# Altium project de10nano.PrjPcb
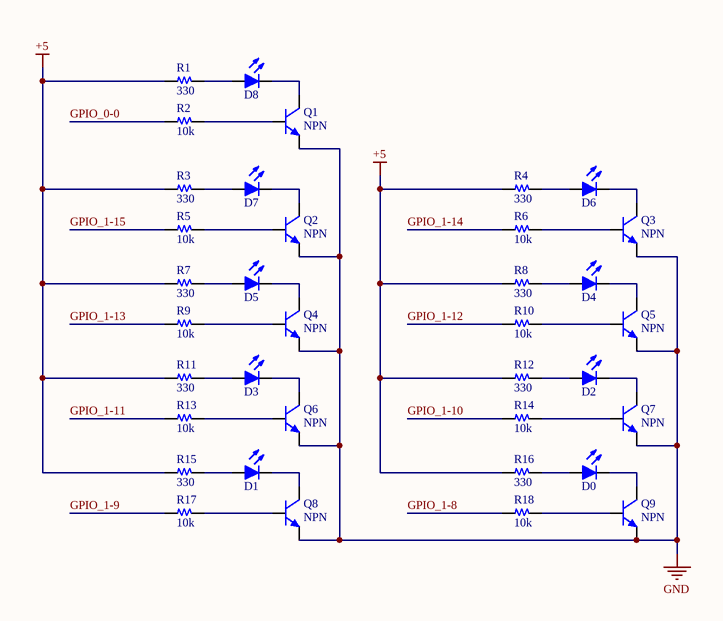
[diagram p0: led.SchDoc]
8 sheets, 203 parts. Net scope: global (net labels, ports and power ports of the same name join across sheets).
Board files: PCB1.PcbDoc, de10nano.PcbDoc, PCB2.PcbDoc
Sheets:
  led.SchDoc
  switch.SchDoc
  7seg.SchDoc
  gpio.SchDoc
  lcd.SchDoc
  buzzer.SchDoc
  button.SchDoc
  matrix.SchDoc

## Sheet led.SchDoc
size A4; SheetNumber: 1; SheetTotal: 8

### Parts
D0  Led  [Led 0805]  (value not drawn)
D1  Led  [Led 0805]  (value not drawn)
D2  Led  [Led 0805]  (value not drawn)
D3  Led  [Led 0805]  (value not drawn)
D4  Led  [Led 0805]  (value not drawn)
D5  Led  [Led 0805]  (value not drawn)
D6  Led  [Led 0805]  (value not drawn)
D7  Led  [Led 0805]  (value not drawn)
D8  Led  [Led 0805 RED]  (value not drawn)
Q1  NPN  [SOT-23]
Q2  NPN  [SOT-23]
Q3  NPN  [SOT-23]
Q4  NPN  [SOT-23]
Q5  NPN  [SOT-23]
Q6  NPN  [SOT-23]
Q7  NPN  [SOT-23]
Q8  NPN  [SOT-23]
Q9  NPN  [SOT-23]
R1  330  [R 0603]
R2  10k  [R 0603]
R3  330  [R 0603]
R4  330  [R 0603]
R5  10k  [R 0603]
R6  10k  [R 0603]
R7  330  [R 0603]
R8  330  [R 0603]
R9  10k  [R 0603]
R10  10k  [R 0603]
R11  330  [R 0603]
R12  330  [R 0603]
R13  10k  [R 0603]
R14  10k  [R 0603]
R15  330  [R 0603]
R16  330  [R 0603]
R17  10k  [R 0603]
R18  10k  [R 0603]

### Nets
+5: R1.1 R3.1 R4.1 R7.1 R8.1 R11.1 R12.1 R15.1 R16.1
GND: Q1.2(E) Q2.2(E) Q3.2(E) Q4.2(E) Q5.2(E) Q6.2(E) Q7.2(E) Q8.2(E) Q9.2(E)
GPIO_0-0: R2.1
GPIO_1-8: R18.1
GPIO_1-9: R17.1
GPIO_1-10: R14.1
GPIO_1-11: R13.1
GPIO_1-12: R10.1
GPIO_1-13: R9.1
GPIO_1-14: R6.1
GPIO_1-15: R5.1
NetD0_1: D0.1(A) R16.2
NetD0_2: D0.2(K) Q9.3(C)
NetD1_1: D1.1(A) R15.2
NetD1_2: D1.2(K) Q8.3(C)
NetD2_1: D2.1(A) R12.2
NetD2_2: D2.2(K) Q7.3(C)
NetD3_1: D3.1(A) R11.2
NetD3_2: D3.2(K) Q6.3(C)
NetD4_1: D4.1(A) R8.2
NetD4_2: D4.2(K) Q5.3(C)
NetD5_1: D5.1(A) R7.2
NetD5_2: D5.2(K) Q4.3(C)
NetD6_1: D6.1(A) R4.2
NetD6_2: D6.2(K) Q3.3(C)
NetD7_1: D7.1(A) R3.2
NetD7_2: D7.2(K) Q2.3(C)
NetD8_1: D8.1(A) R1.2
NetD8_2: D8.2(K) Q1.3(C)
NetQ1_1: Q1.1(B) R2.2
NetQ2_1: Q2.1(B) R5.2
NetQ3_1: Q3.1(B) R6.2
NetQ4_1: Q4.1(B) R9.2
NetQ5_1: Q5.1(B) R10.2
NetQ6_1: Q6.1(B) R13.2
NetQ7_1: Q7.1(B) R14.2
NetQ8_1: Q8.1(B) R17.2
NetQ9_1: Q9.1(B) R18.2

### Library data of the parts
D0-D8 = Led: Typical LED
Q1-Q9 = Transistor NPN: NPN Bipolar Transistor
R1-R18 = Resistor

## Sheet switch.SchDoc
size A4; SheetNumber: 2; SheetTotal: 8
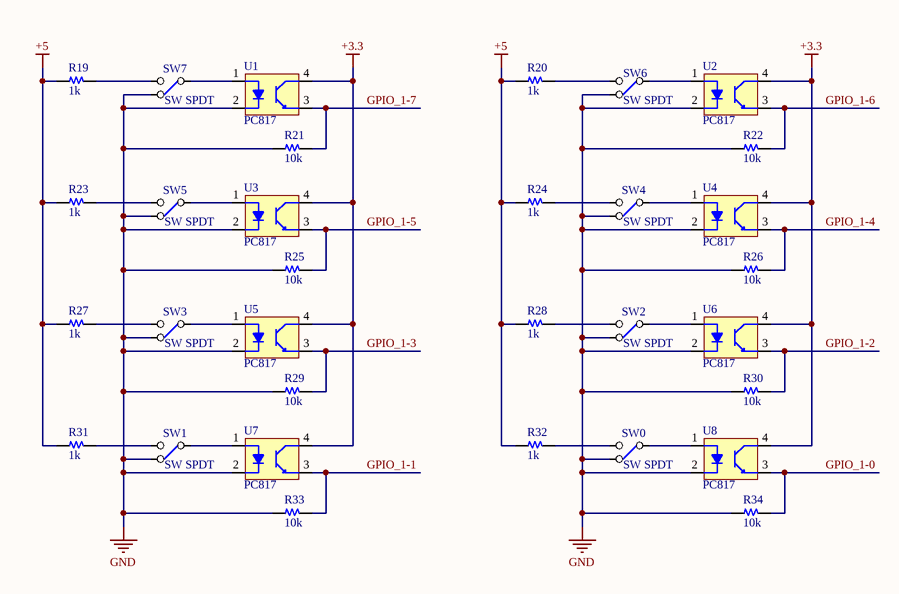
[diagram p1: switch.SchDoc]

### Parts
R19  1k  [R 0603]
R20  1k  [R 0603]
R21  10k  [R 0603]
R22  10k  [R 0603]
R23  1k  [R 0603]
R24  1k  [R 0603]
R25  10k  [R 0603]
R26  10k  [R 0603]
R27  1k  [R 0603]
R28  1k  [R 0603]
R29  10k  [R 0603]
R30  10k  [R 0603]
R31  1k  [R 0603]
R32  1k  [R 0603]
R33  10k  [R 0603]
R34  10k  [R 0603]
SW0  SW SPDT  [SW/3/SPDT/SS12D10]
SW1  SW SPDT  [SW/3/SPDT/SS12D10]
SW2  SW SPDT  [SW/3/SPDT/SS12D10]
SW3  SW SPDT  [SW/3/SPDT/SS12D10]
SW4  SW SPDT  [SW/3/SPDT/SS12D10]
SW5  SW SPDT  [SW/3/SPDT/SS12D10]
SW6  SW SPDT  [SW/3/SPDT/SS12D10]
SW7  SW SPDT  [SW/3/SPDT/SS12D10]
U1  PC817  [SOP4 - PC817]
U2  PC817  [SOP4 - PC817]
U3  PC817  [SOP4 - PC817]
U4  PC817  [SOP4 - PC817]
U5  PC817  [SOP4 - PC817]
U6  PC817  [SOP4 - PC817]
U7  PC817  [SOP4 - PC817]
U8  PC817  [SOP4 - PC817]

### Nets
+3.3: U1.4(C) U2.4(C) U3.4(C) U4.4(C) U5.4(C) U6.4(C) U7.4(C) U8.4(C)
+5: R19.1 R20.1 R23.1 R24.1 R27.1 R28.1 R31.1 R32.1
GND: R21.1 R22.1 R25.1 R26.1 R29.1 R30.1 R33.1 R34.1 SW0.1(NC1) SW1.1(NC1) SW2.1(NC1) SW3.1(NC1) SW4.1(NC1) SW5.1(NC1) SW6.1(NC1) SW7.1(NC1) U1.2(K) U2.2(K) U3.2(K) U4.2(K) U5.2(K) U6.2(K) U7.2(K) U8.2(K)
GPIO_1-0: R34.2 U8.3(E)
GPIO_1-1: R33.2 U7.3(E)
GPIO_1-2: R30.2 U6.3(E)
GPIO_1-3: R29.2 U5.3(E)
GPIO_1-4: R26.2 U4.3(E)
GPIO_1-5: R25.2 U3.3(E)
GPIO_1-6: R22.2 U2.3(E)
GPIO_1-7: R21.2 U1.3(E)
NetR19_2: R19.2 SW7.3(NO1)
NetR20_2: R20.2 SW6.3(NO1)
NetR23_2: R23.2 SW5.3(NO1)
NetR24_2: R24.2 SW4.3(NO1)
NetR27_2: R27.2 SW3.3(NO1)
NetR28_2: R28.2 SW2.3(NO1)
NetR31_2: R31.2 SW1.3(NO1)
NetR32_2: R32.2 SW0.3(NO1)
NetSW0_2: SW0.2(COMMON1) U8.1(A)
NetSW1_2: SW1.2(COMMON1) U7.1(A)
NetSW2_2: SW2.2(COMMON1) U6.1(A)
NetSW3_2: SW3.2(COMMON1) U5.1(A)
NetSW4_2: SW4.2(COMMON1) U4.1(A)
NetSW5_2: SW5.2(COMMON1) U3.1(A)
NetSW6_2: SW6.2(COMMON1) U2.1(A)
NetSW7_2: SW7.2(COMMON1) U1.1(A)

### Library data of the parts
R19-R34 = Resistor
U1-U8 = PC817: Opto PC817B

## Sheet 7seg.SchDoc
size A3; SheetNumber: 3; SheetTotal: 8
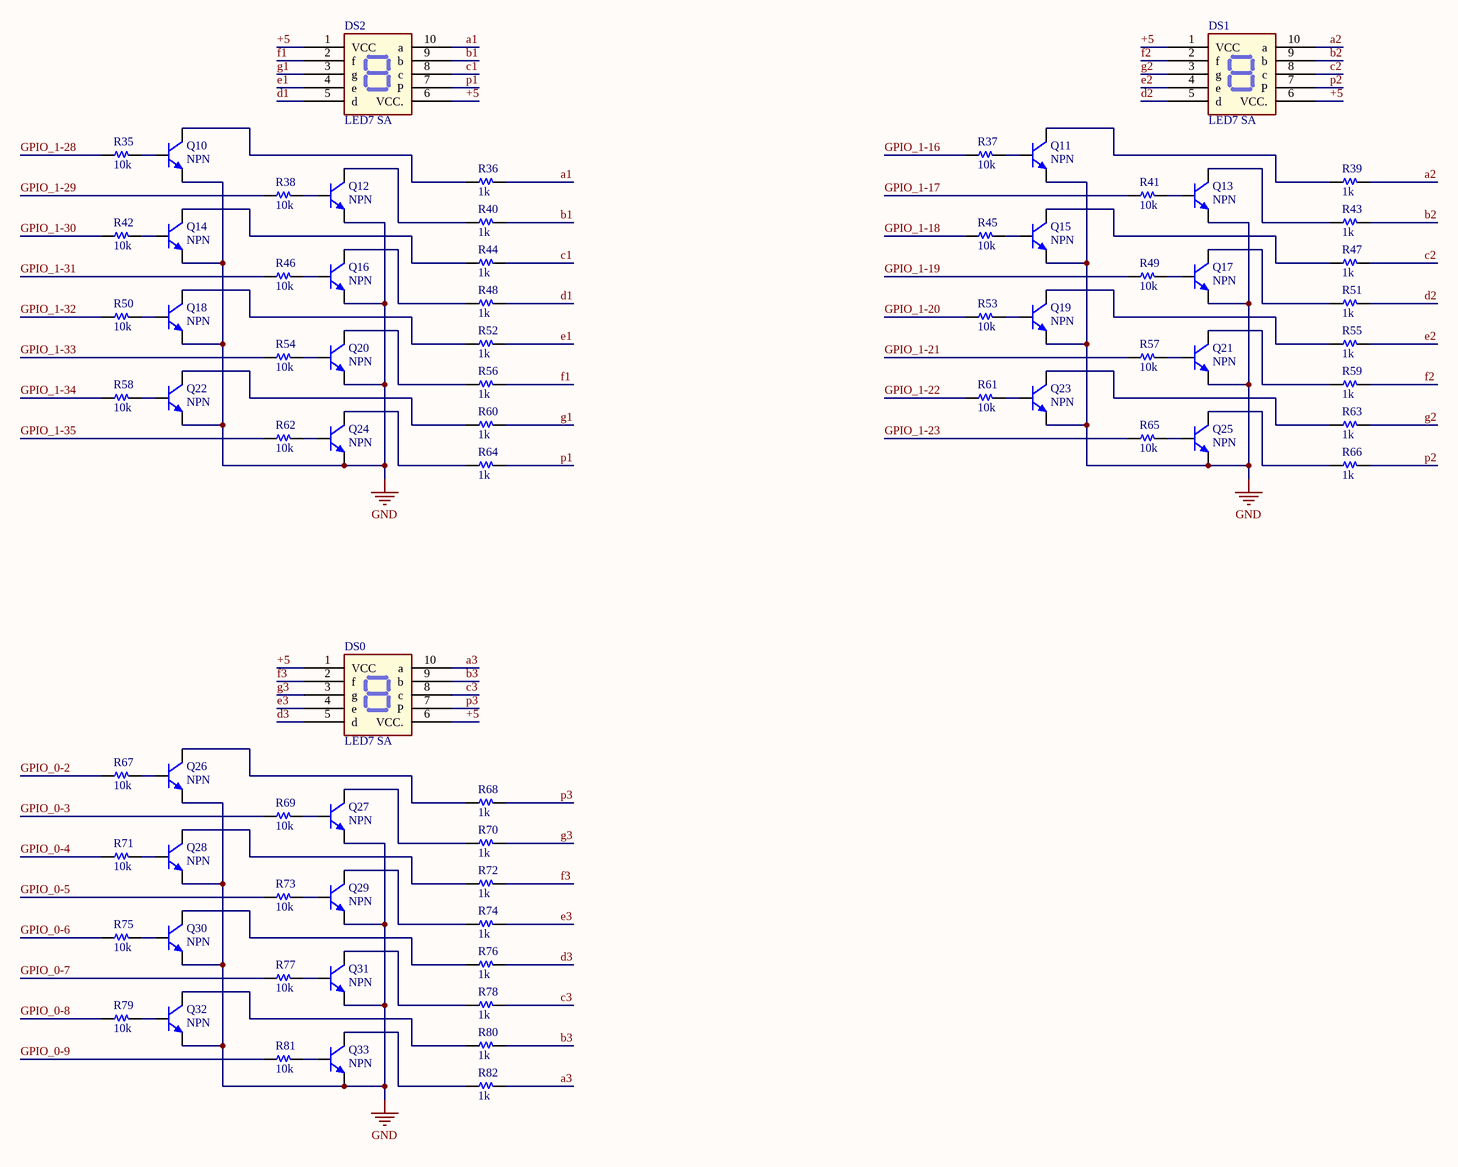
[diagram p2: 7seg.SchDoc]

### Parts
DS0  LED7 SA  [Led7seg 0.36in]
DS1  LED7 SA  [Led7seg 0.36in]
DS2  LED7 SA  [Led7seg 0.36in]
Q10  NPN  [SOT-23]
Q11  NPN  [SOT-23]
Q12  NPN  [SOT-23]
Q13  NPN  [SOT-23]
Q14  NPN  [SOT-23]
Q15  NPN  [SOT-23]
Q16  NPN  [SOT-23]
Q17  NPN  [SOT-23]
Q18  NPN  [SOT-23]
Q19  NPN  [SOT-23]
Q20  NPN  [SOT-23]
Q21  NPN  [SOT-23]
Q22  NPN  [SOT-23]
Q23  NPN  [SOT-23]
Q24  NPN  [SOT-23]
Q25  NPN  [SOT-23]
Q26  NPN  [SOT-23]
Q27  NPN  [SOT-23]
Q28  NPN  [SOT-23]
Q29  NPN  [SOT-23]
Q30  NPN  [SOT-23]
Q31  NPN  [SOT-23]
Q32  NPN  [SOT-23]
Q33  NPN  [SOT-23]
R35  10k  [R 0603]
R36  1k  [R 0603]
R37  10k  [R 0603]
R38  10k  [R 0603]
R39  1k  [R 0603]
R40  1k  [R 0603]
R41  10k  [R 0603]
R42  10k  [R 0603]
R43  1k  [R 0603]
R44  1k  [R 0603]
R45  10k  [R 0603]
R46  10k  [R 0603]
R47  1k  [R 0603]
R48  1k  [R 0603]
R49  10k  [R 0603]
R50  10k  [R 0603]
R51  1k  [R 0603]
R52  1k  [R 0603]
R53  10k  [R 0603]
R54  10k  [R 0603]
R55  1k  [R 0603]
R56  1k  [R 0603]
R57  10k  [R 0603]
R58  10k  [R 0603]
R59  1k  [R 0603]
R60  1k  [R 0603]
R61  10k  [R 0603]
R62  10k  [R 0603]
R63  1k  [R 0603]
R64  1k  [R 0603]
R65  10k  [R 0603]
R66  1k  [R 0603]
R67  10k  [R 0603]
R68  1k  [R 0603]
R69  10k  [R 0603]
R70  1k  [R 0603]
R71  10k  [R 0603]
R72  1k  [R 0603]
R73  10k  [R 0603]
R74  1k  [R 0603]
R75  10k  [R 0603]
R76  1k  [R 0603]
R77  10k  [R 0603]
R78  1k  [R 0603]
R79  10k  [R 0603]
R80  1k  [R 0603]
R81  10k  [R 0603]
R82  1k  [R 0603]

### Nets
+5: DS0.1(VCC) DS0.6(VCC.) DS1.1(VCC) DS1.6(VCC.) DS2.1(VCC) DS2.6(VCC.)
GND: Q10.2(E) Q11.2(E) Q12.2(E) Q13.2(E) Q14.2(E) Q15.2(E) Q16.2(E) Q17.2(E) Q18.2(E) Q19.2(E) Q20.2(E) Q21.2(E) Q22.2(E) Q23.2(E) Q24.2(E) Q25.2(E) Q26.2(E) Q27.2(E) Q28.2(E) Q29.2(E) Q30.2(E) Q31.2(E) Q32.2(E) Q33.2(E)
a1: DS2.10(a) R36.2
a2: DS1.10(a) R39.2
a3: DS0.10(a) R82.2
b1: DS2.9(b) R40.2
b2: DS1.9(b) R43.2
b3: DS0.9(b) R80.2
c1: DS2.8(c) R44.2
c2: DS1.8(c) R47.2
c3: DS0.8(c) R78.2
d1: DS2.5(d) R48.2
d2: DS1.5(d) R51.2
d3: DS0.5(d) R76.2
e1: DS2.4(e) R52.2
e2: DS1.4(e) R55.2
e3: DS0.4(e) R74.2
f1: DS2.2(f) R56.2
f2: DS1.2(f) R59.2
f3: DS0.2(f) R72.2
g1: DS2.3(g) R60.2
g2: DS1.3(g) R63.2
g3: DS0.3(g) R70.2
GPIO_0-2: R67.1
GPIO_0-3: R69.1
GPIO_0-4: R71.1
GPIO_0-5: R73.1
GPIO_0-6: R75.1
GPIO_0-7: R77.1
GPIO_0-8: R79.1
GPIO_0-9: R81.1
GPIO_1-16: R37.1
GPIO_1-17: R41.1
GPIO_1-18: R45.1
GPIO_1-19: R49.1
GPIO_1-20: R53.1
GPIO_1-21: R57.1
GPIO_1-22: R61.1
GPIO_1-23: R65.1
GPIO_1-28: R35.1
GPIO_1-29: R38.1
GPIO_1-30: R42.1
GPIO_1-31: R46.1
GPIO_1-32: R50.1
GPIO_1-33: R54.1
GPIO_1-34: R58.1
GPIO_1-35: R62.1
p1: DS2.7(P) R64.2
p2: DS1.7(P) R66.2
p3: DS0.7(P) R68.2
NetQ10_1: Q10.1(B) R35.2
NetQ10_3: Q10.3(C) R36.1
NetQ11_1: Q11.1(B) R37.2
NetQ11_3: Q11.3(C) R39.1
NetQ12_1: Q12.1(B) R38.2
NetQ12_3: Q12.3(C) R40.1
NetQ13_1: Q13.1(B) R41.2
NetQ13_3: Q13.3(C) R43.1
NetQ14_1: Q14.1(B) R42.2
NetQ14_3: Q14.3(C) R44.1
NetQ15_1: Q15.1(B) R45.2
NetQ15_3: Q15.3(C) R47.1
NetQ16_1: Q16.1(B) R46.2
NetQ16_3: Q16.3(C) R48.1
NetQ17_1: Q17.1(B) R49.2
NetQ17_3: Q17.3(C) R51.1
NetQ18_1: Q18.1(B) R50.2
NetQ18_3: Q18.3(C) R52.1
NetQ19_1: Q19.1(B) R53.2
NetQ19_3: Q19.3(C) R55.1
NetQ20_1: Q20.1(B) R54.2
NetQ20_3: Q20.3(C) R56.1
NetQ21_1: Q21.1(B) R57.2
NetQ21_3: Q21.3(C) R59.1
NetQ22_1: Q22.1(B) R58.2
NetQ22_3: Q22.3(C) R60.1
NetQ23_1: Q23.1(B) R61.2
NetQ23_3: Q23.3(C) R63.1
NetQ24_1: Q24.1(B) R62.2
NetQ24_3: Q24.3(C) R64.1
NetQ25_1: Q25.1(B) R65.2
NetQ25_3: Q25.3(C) R66.1
NetQ26_1: Q26.1(B) R67.2
NetQ26_3: Q26.3(C) R68.1
NetQ27_1: Q27.1(B) R69.2
NetQ27_3: Q27.3(C) R70.1
NetQ28_1: Q28.1(B) R71.2
NetQ28_3: Q28.3(C) R72.1
NetQ29_1: Q29.1(B) R73.2
NetQ29_3: Q29.3(C) R74.1
NetQ30_1: Q30.1(B) R75.2
NetQ30_3: Q30.3(C) R76.1
NetQ31_1: Q31.1(B) R77.2
NetQ31_3: Q31.3(C) R78.1
NetQ32_1: Q32.1(B) R79.2
NetQ32_3: Q32.3(C) R80.1
NetQ33_1: Q33.1(B) R81.2
NetQ33_3: Q33.3(C) R82.1

### Library data of the parts
Q10-Q33 = Transistor NPN: NPN Bipolar Transistor
R35-R82 = Resistor

## Sheet gpio.SchDoc
size A4; SheetNumber: 4; SheetTotal: 8
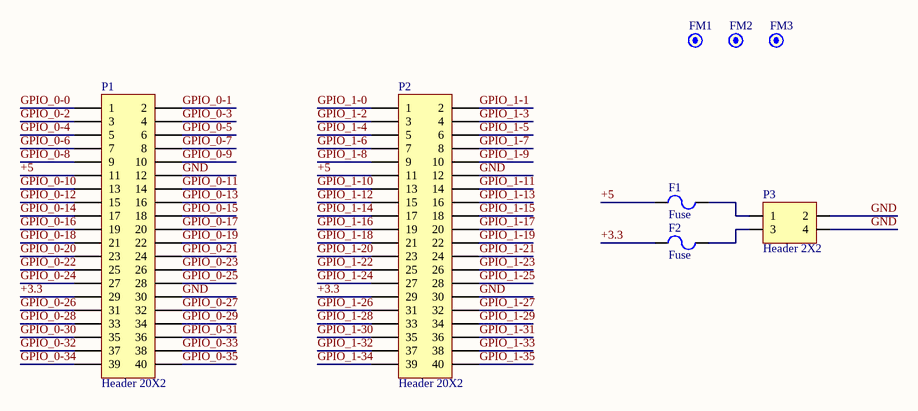
[diagram p3: gpio.SchDoc]

### Parts
F1  Fuse  [Fuse 1206]
F2  Fuse  [Fuse 1206]
FM1  Fiducial  [Fiducial]  (value not drawn)
FM2  Fiducial  [Fiducial]  (value not drawn)
FM3  Fiducial  [Fiducial]  (value not drawn)
P1  Header 20X2  [Header FM 2x20]
P2  Header 20X2  [Header FM 2x20]
P3  Header 2X2  [HDR/Header/4/DL]

### Nets
+3.3: F2.1 P1.29 P2.29
+5: F1.1 P1.11 P2.11
GND: P1.12 P1.30 P2.12 P2.30 P3.2 P3.4
GPIO_0-0: P1.1
GPIO_0-1: P1.2
GPIO_0-2: P1.3
GPIO_0-3: P1.4
GPIO_0-4: P1.5
GPIO_0-5: P1.6
GPIO_0-6: P1.7
GPIO_0-7: P1.8
GPIO_0-8: P1.9
GPIO_0-9: P1.10
GPIO_0-10: P1.13
GPIO_0-11: P1.14
GPIO_0-12: P1.15
GPIO_0-13: P1.16
GPIO_0-14: P1.17
GPIO_0-15: P1.18
GPIO_0-16: P1.19
GPIO_0-17: P1.20
GPIO_0-18: P1.21
GPIO_0-19: P1.22
GPIO_0-20: P1.23
GPIO_0-21: P1.24
GPIO_0-22: P1.25
GPIO_0-23: P1.26
GPIO_0-24: P1.27
GPIO_0-25: P1.28
GPIO_0-26: P1.31
GPIO_0-27: P1.32
GPIO_0-28: P1.33
GPIO_0-29: P1.34
GPIO_0-30: P1.35
GPIO_0-31: P1.36
GPIO_0-32: P1.37
GPIO_0-33: P1.38
GPIO_0-34: P1.39
GPIO_0-35: P1.40
GPIO_1-0: P2.1
GPIO_1-1: P2.2
GPIO_1-2: P2.3
GPIO_1-3: P2.4
GPIO_1-4: P2.5
GPIO_1-5: P2.6
GPIO_1-6: P2.7
GPIO_1-7: P2.8
GPIO_1-8: P2.9
GPIO_1-9: P2.10
GPIO_1-10: P2.13
GPIO_1-11: P2.14
GPIO_1-12: P2.15
GPIO_1-13: P2.16
GPIO_1-14: P2.17
GPIO_1-15: P2.18
GPIO_1-16: P2.19
GPIO_1-17: P2.20
GPIO_1-18: P2.21
GPIO_1-19: P2.22
GPIO_1-20: P2.23
GPIO_1-21: P2.24
GPIO_1-22: P2.25
GPIO_1-23: P2.26
GPIO_1-24: P2.27
GPIO_1-25: P2.28
GPIO_1-26: P2.31
GPIO_1-27: P2.32
GPIO_1-28: P2.33
GPIO_1-29: P2.34
GPIO_1-30: P2.35
GPIO_1-31: P2.36
GPIO_1-32: P2.37
GPIO_1-33: P2.38
GPIO_1-34: P2.39
GPIO_1-35: P2.40
NetF1_2: F1.2 P3.1
NetF2_2: F2.2 P3.3

### Library data of the parts
FM1-FM3 = Fiducial: Fiducial Marker
P1 P2 = Header 20X2: Header, 20-Pin, Dual row; LatestRevisionDate: 17-Jul-2002; LatestRevisionNote: Re-released for DXP Platform.; Publisher: Altium Limited
P3 = Header 2X2: Header, 2-Pin, Dual row

## Sheet lcd.SchDoc
size A4; SheetNumber: 5; SheetTotal: 8
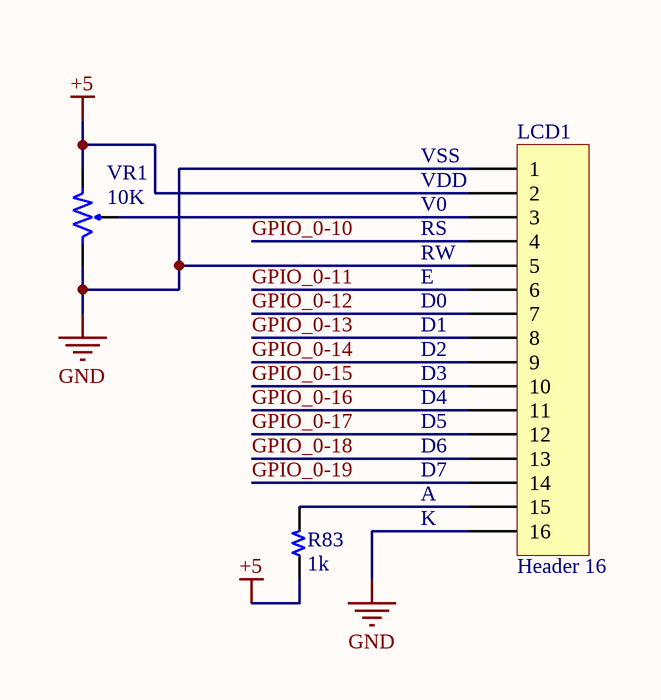
[diagram p4: lcd.SchDoc]

### Parts
LCD1  Header 16  [HDR1X16]
R83  1k  [R 0603]
VR1  10K  [VR1]

### Nets
+5: LCD1.2 R83.1 VR1.1
GND: LCD1.1 LCD1.5 LCD1.16 VR1.3
GPIO_0-10: LCD1.4
GPIO_0-11: LCD1.6
GPIO_0-12: LCD1.7
GPIO_0-13: LCD1.8
GPIO_0-14: LCD1.9
GPIO_0-15: LCD1.10
GPIO_0-16: LCD1.11
GPIO_0-17: LCD1.12
GPIO_0-18: LCD1.13
GPIO_0-19: LCD1.14
NetLCD1_3: LCD1.3 VR1.2
NetLCD1_15: LCD1.15 R83.2

### Notes on the sheet
- (near LCD1) VSS
- (near LCD1) VDD
- (near LCD1) V0
- (near LCD1) RS
- (near LCD1) RW
- (near LCD1) E
- (near LCD1) D0
- (near LCD1) D1
- (near LCD1) D2
- (near LCD1) D3
- (near LCD1) D4
- (near LCD1) D5
- (near LCD1) D6
- (near LCD1) D7
- A
- K

### Library data of the parts
LCD1 = Header 16: Header, 16-Pin; LatestRevisionDate: 17-Jul-2002; LatestRevisionNote: Re-released for DXP Platform.; Publisher: Altium Limited
R83 = Resistor
VR1 = VR1: Var Resistor; Value: VR 10K

## Sheet buzzer.SchDoc
size A4; SheetNumber: 6; SheetTotal: 8
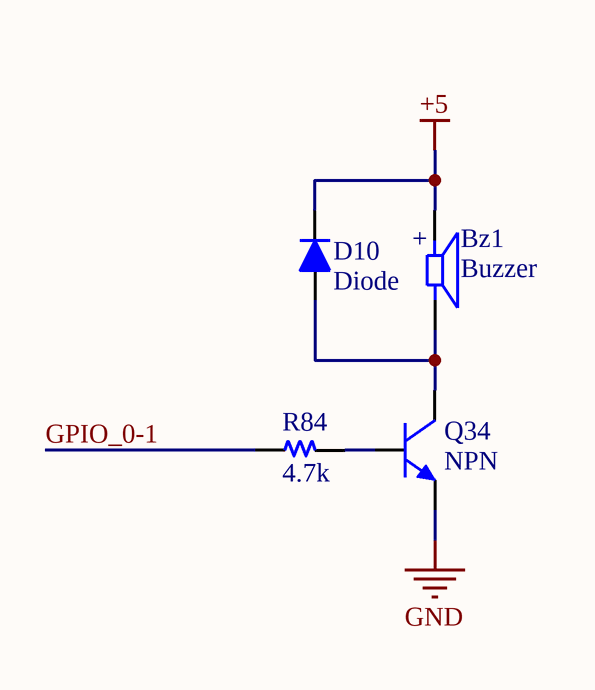
[diagram p5: buzzer.SchDoc]

### Parts
Bz1  Buzzer  [CUI_CMT-8530S-SMT]
D10  Diode  [SOD123]
Q34  NPN  [SOT-23]
R84  4.7k  [R 0603]

### Nets
+5: Bz1.P D10.2(K)
GND: Q34.2(E)
GPIO_0-1: R84.1
NetBz1_N: Bz1.N D10.1(A) Q34.3(C)
NetQ34_1: Q34.1(B) R84.2

### Notes on the sheet
- (in symbol CMT-8530S-SMT) +

### Library data of the parts
Bz1 = CMT-8530S-SMT: 8.5 mm, 3.6 Vo-p, 90 dB, Surface Mount _SMT_, Magnetic Audio Transducer Buzzer; MP: CMT-8530S-SMT-TR; MF: CUI Devices; Availability: Unavailable; SnapEDA_Link: https://www.snapeda.com/parts/CMT-8530S-SMT-TR/CUI%20Devices/view-part/649163/?ref=snap; CUI_purchase_URL: https://www.cuidevices.com/product/audio/buzzers/audio-transducers/cmt-8530s-smt-tr?utm_source=snapeda.com&utm_medium=referral&utm_campaign=snapedaBOM; Package: CUI; Price: None; Value: *
D10 = Diode: Default Diode
Q34 = Transistor NPN: NPN Bipolar Transistor
R84 = Resistor

## Sheet button.SchDoc
size A4; SheetNumber: 7; SheetTotal: 8
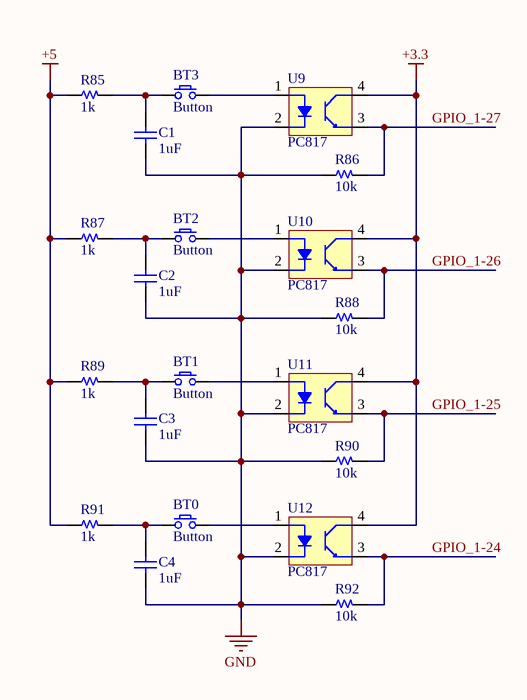
[diagram p6: button.SchDoc]

### Parts
BT0  Button  [SW/4/SMD/XS]
BT1  Button  [SW/4/SMD/XS]
BT2  Button  [SW/4/SMD/XS]
BT3  Button  [SW/4/SMD/XS]
C1  1uF  [C 0603]
C2  1uF  [C 0603]
C3  1uF  [C 0603]
C4  1uF  [C 0603]
R85  1k  [R 0603]
R86  10k  [R 0603]
R87  1k  [R 0603]
R88  10k  [R 0603]
R89  1k  [R 0603]
R90  10k  [R 0603]
R91  1k  [R 0603]
R92  10k  [R 0603]
U9  PC817  [SOP4 - PC817]
U10  PC817  [SOP4 - PC817]
U11  PC817  [SOP4 - PC817]
U12  PC817  [SOP4 - PC817]

### Nets
+3.3: U9.4(C) U10.4(C) U11.4(C) U12.4(C)
+5: R85.1 R87.1 R89.1 R91.1
GND: C1.1 C2.1 C3.1 C4.1 R86.1 R88.1 R90.1 R92.1 U9.2(K) U10.2(K) U11.2(K) U12.2(K)
GPIO_1-24: R92.2 U12.3(E)
GPIO_1-25: R90.2 U11.3(E)
GPIO_1-26: R88.2 U10.3(E)
GPIO_1-27: R86.2 U9.3(E)
NetBT0_1: BT0.1 C4.2 R91.2
NetBT0_2: BT0.2 U12.1(A)
NetBT1_1: BT1.1 C3.2 R89.2
NetBT1_2: BT1.2 U11.1(A)
NetBT2_1: BT2.1 C2.2 R87.2
NetBT2_2: BT2.2 U10.1(A)
NetBT3_1: BT3.1 C1.2 R85.2
NetBT3_2: BT3.2 U9.1(A)

### Library data of the parts
BT0-BT3 = SW SPST: Tact switch 2 pin
C1-C4 = Capacitor NP: Capacitor non-pol
R85-R92 = Resistor
U9-U12 = PC817: Opto PC817B

## Sheet matrix.SchDoc
size A4; SheetNumber: 8; SheetTotal: 8
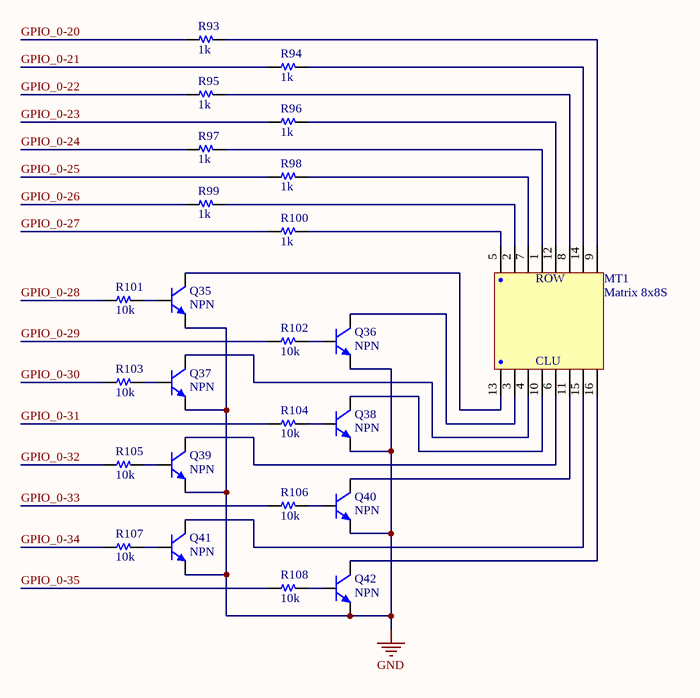
[diagram p7: matrix.SchDoc]

### Parts
MT1  Matrix 8x8S  [Led Matrix 1.9mm]
Q35  NPN  [SOT-23]
Q36  NPN  [SOT-23]
Q37  NPN  [SOT-23]
Q38  NPN  [SOT-23]
Q39  NPN  [SOT-23]
Q40  NPN  [SOT-23]
Q41  NPN  [SOT-23]
Q42  NPN  [SOT-23]
R93  1k  [R 0603]
R94  1k  [R 0603]
R95  1k  [R 0603]
R96  1k  [R 0603]
R97  1k  [R 0603]
R98  1k  [R 0603]
R99  1k  [R 0603]
R100  1k  [R 0603]
R101  10k  [R 0603]
R102  10k  [R 0603]
R103  10k  [R 0603]
R104  10k  [R 0603]
R105  10k  [R 0603]
R106  10k  [R 0603]
R107  10k  [R 0603]
R108  10k  [R 0603]

### Nets
GND: Q35.2(E) Q36.2(E) Q37.2(E) Q38.2(E) Q39.2(E) Q40.2(E) Q41.2(E) Q42.2(E)
GPIO_0-20: R93.1
GPIO_0-21: R94.1
GPIO_0-22: R95.1
GPIO_0-23: R96.1
GPIO_0-24: R97.1
GPIO_0-25: R98.1
GPIO_0-26: R99.1
GPIO_0-27: R100.1
GPIO_0-28: R101.1
GPIO_0-29: R102.1
GPIO_0-30: R103.1
GPIO_0-31: R104.1
GPIO_0-32: R105.1
GPIO_0-33: R106.1
GPIO_0-34: R107.1
GPIO_0-35: R108.1
NetMT1_1: MT1.1(H4) R97.2
NetMT1_2: MT1.2(H2) R99.2
NetMT1_3: MT1.3(C2) Q36.3(C)
NetMT1_4: MT1.4(C3) Q37.3(C)
NetMT1_5: MT1.5(H1) R100.2
NetMT1_6: MT1.6(C5) Q39.3(C)
NetMT1_7: MT1.7(H3) R98.2
NetMT1_8: MT1.8(H6) R95.2
NetMT1_9: MT1.9(H8) R93.2
NetMT1_10: MT1.10(C4) Q38.3(C)
NetMT1_11: MT1.11(C6) Q40.3(C)
NetMT1_12: MT1.12(H5) R96.2
NetMT1_13: MT1.13(C1) Q35.3(C)
NetMT1_14: MT1.14(H7) R94.2
NetMT1_15: MT1.15(C7) Q41.3(C)
NetMT1_16: MT1.16(C8) Q42.3(C)
NetQ35_1: Q35.1(B) R101.2
NetQ36_1: Q36.1(B) R102.2
NetQ37_1: Q37.1(B) R103.2
NetQ38_1: Q38.1(B) R104.2
NetQ39_1: Q39.1(B) R105.2
NetQ40_1: Q40.1(B) R106.2
NetQ41_1: Q41.1(B) R107.2
NetQ42_1: Q42.1(B) R108.2

### Notes on the sheet
- (in symbol LED 8x8S) ROW; CLU

### Library data of the parts
MT1 = LED 8x8S: Matrix 8x8,  Single colour; Value: Matrix 8x8S
Q35-Q42 = Transistor NPN: NPN Bipolar Transistor
R93-R108 = Resistor

## Nets that join several sheets
+3.3: switch (8 pins), gpio (F2.1 P1.29 P2.29), button (U9.4 U10.4 U11.4 U12.4)
+5: led (9 pins), switch (8 pins), 7seg (6 pins), gpio (F1.1 P1.11 P2.11), lcd (LCD1.2 R83.1 VR1.1), buzzer (Bz1.P D10.2), button (R85.1 R87.1 R89.1 R91.1)
GND: led (9 pins), switch (24 pins), 7seg (24 pins), gpio (6 pins), lcd (LCD1.1 LCD1.5 LCD1.16 VR1.3), buzzer (Q34.2), button (12 pins), matrix (8 pins)
GPIO_0-0: led (R2.1), gpio (P1.1)
GPIO_0-1: gpio (P1.2), buzzer (R84.1)
GPIO_0-2: 7seg (R67.1), gpio (P1.3)
GPIO_0-3: 7seg (R69.1), gpio (P1.4)
GPIO_0-4: 7seg (R71.1), gpio (P1.5)
GPIO_0-5: 7seg (R73.1), gpio (P1.6)
GPIO_0-6: 7seg (R75.1), gpio (P1.7)
GPIO_0-7: 7seg (R77.1), gpio (P1.8)
GPIO_0-8: 7seg (R79.1), gpio (P1.9)
GPIO_0-9: 7seg (R81.1), gpio (P1.10)
GPIO_0-10: gpio (P1.13), lcd (LCD1.4)
GPIO_0-11: gpio (P1.14), lcd (LCD1.6)
GPIO_0-12: gpio (P1.15), lcd (LCD1.7)
GPIO_0-13: gpio (P1.16), lcd (LCD1.8)
GPIO_0-14: gpio (P1.17), lcd (LCD1.9)
GPIO_0-15: gpio (P1.18), lcd (LCD1.10)
GPIO_0-16: gpio (P1.19), lcd (LCD1.11)
GPIO_0-17: gpio (P1.20), lcd (LCD1.12)
GPIO_0-18: gpio (P1.21), lcd (LCD1.13)
GPIO_0-19: gpio (P1.22), lcd (LCD1.14)
GPIO_0-20: gpio (P1.23), matrix (R93.1)
GPIO_0-21: gpio (P1.24), matrix (R94.1)
GPIO_0-22: gpio (P1.25), matrix (R95.1)
GPIO_0-23: gpio (P1.26), matrix (R96.1)
GPIO_0-24: gpio (P1.27), matrix (R97.1)
GPIO_0-25: gpio (P1.28), matrix (R98.1)
GPIO_0-26: gpio (P1.31), matrix (R99.1)
GPIO_0-27: gpio (P1.32), matrix (R100.1)
GPIO_0-28: gpio (P1.33), matrix (R101.1)
GPIO_0-29: gpio (P1.34), matrix (R102.1)
GPIO_0-30: gpio (P1.35), matrix (R103.1)
GPIO_0-31: gpio (P1.36), matrix (R104.1)
GPIO_0-32: gpio (P1.37), matrix (R105.1)
GPIO_0-33: gpio (P1.38), matrix (R106.1)
GPIO_0-34: gpio (P1.39), matrix (R107.1)
GPIO_0-35: gpio (P1.40), matrix (R108.1)
GPIO_1-0: switch (R34.2 U8.3), gpio (P2.1)
GPIO_1-1: switch (R33.2 U7.3), gpio (P2.2)
GPIO_1-2: switch (R30.2 U6.3), gpio (P2.3)
GPIO_1-3: switch (R29.2 U5.3), gpio (P2.4)
GPIO_1-4: switch (R26.2 U4.3), gpio (P2.5)
GPIO_1-5: switch (R25.2 U3.3), gpio (P2.6)
GPIO_1-6: switch (R22.2 U2.3), gpio (P2.7)
GPIO_1-7: switch (R21.2 U1.3), gpio (P2.8)
GPIO_1-8: led (R18.1), gpio (P2.9)
GPIO_1-9: led (R17.1), gpio (P2.10)
GPIO_1-10: led (R14.1), gpio (P2.13)
GPIO_1-11: led (R13.1), gpio (P2.14)
GPIO_1-12: led (R10.1), gpio (P2.15)
GPIO_1-13: led (R9.1), gpio (P2.16)
GPIO_1-14: led (R6.1), gpio (P2.17)
GPIO_1-15: led (R5.1), gpio (P2.18)
GPIO_1-16: 7seg (R37.1), gpio (P2.19)
GPIO_1-17: 7seg (R41.1), gpio (P2.20)
GPIO_1-18: 7seg (R45.1), gpio (P2.21)
GPIO_1-19: 7seg (R49.1), gpio (P2.22)
GPIO_1-20: 7seg (R53.1), gpio (P2.23)
GPIO_1-21: 7seg (R57.1), gpio (P2.24)
GPIO_1-22: 7seg (R61.1), gpio (P2.25)
GPIO_1-23: 7seg (R65.1), gpio (P2.26)
GPIO_1-24: gpio (P2.27), button (R92.2 U12.3)
GPIO_1-25: gpio (P2.28), button (R90.2 U11.3)
GPIO_1-26: gpio (P2.31), button (R88.2 U10.3)
GPIO_1-27: gpio (P2.32), button (R86.2 U9.3)
GPIO_1-28: 7seg (R35.1), gpio (P2.33)
GPIO_1-29: 7seg (R38.1), gpio (P2.34)
GPIO_1-30: 7seg (R42.1), gpio (P2.35)
GPIO_1-31: 7seg (R46.1), gpio (P2.36)
GPIO_1-32: 7seg (R50.1), gpio (P2.37)
GPIO_1-33: 7seg (R54.1), gpio (P2.38)
GPIO_1-34: 7seg (R58.1), gpio (P2.39)
GPIO_1-35: 7seg (R62.1), gpio (P2.40)